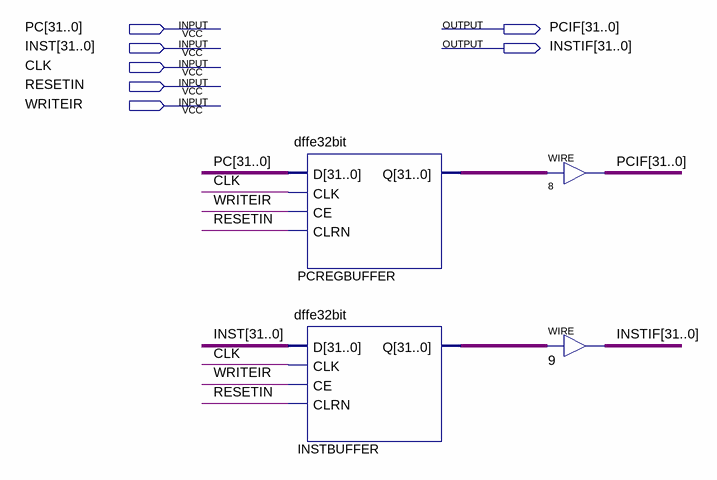
[diagram p0: schematic sheet]
// Quartus schematic IF-ID-INSTPC-BUFFER.bdf as structural Verilog: 4 symbols, 7 pins
module \IF-ID-INSTPC-BUFFER  (
  input  [31:0] PC,
  input  [31:0] INST,
  input  CLK,
  input  RESETIN,
  input  WRITEIR,
  output [31:0] PCIF,
  output [31:0] INSTIF
);

  wire [31:0] INSTBUFFER_q, PCREGBUFFER_q;

  dffe32bit PCREGBUFFER (.D(PC), .CLK(CLK), .CE(WRITEIR), .CLRN(RESETIN), .Q(PCREGBUFFER_q));
  dffe32bit INSTBUFFER (.D(INST), .CLK(CLK), .CE(WRITEIR), .CLRN(RESETIN), .Q(INSTBUFFER_q));
  assign PCIF = PCREGBUFFER_q;  // WIRE 8
  assign INSTIF = INSTBUFFER_q;  // WIRE 9
endmodule
